# Altium schematic sheet PR2387_FETs.SchDoc: FETs
size 431 x 279 mm; Date: Not shown in title block; ApprovedBy: Not shown in title block; CheckedBy: Not shown in title block; Author: Not shown in title block; CompanyName: Not shown in title block; DrawnBy: M Sunna; Engineer: Not shown in title block; Organization: Not shown in title block; Address1: Not shown in title block; Address2: Not shown in title block; Address3: Not shown in title block; Address4: Not shown in title block; DocumentNumber: 2; Revision: Use project parameter SCH_Rev; SheetNumber: 2; SheetTotal: 3; PageSetup: Record=PageOptions|CenterHorizontal=True|CenterVertical=True|PrintScale=1.00|XCorrection=1.00|YCorrection=1.00|PrintKind=0|BorderSize=5000000|LeftOffset=0|BottomOffset=0|Orientation=2|PaperLength=1000|PaperWidth=1000|Scale=100|PaperSource=15|PrintQuality=600|MediaType=1|DitherType=10|PaperKind=Letter|PrintScaleMode=1; CurrentTime: Not shown in title block; CurrentDate: Not shown in title block; Time: Not shown in title block; DocumentFullPathAndName: Not shown in title block; DocumentName: Not shown in title block; ModifiedDate: Not shown in title block; ImagePath: Not shown in title block
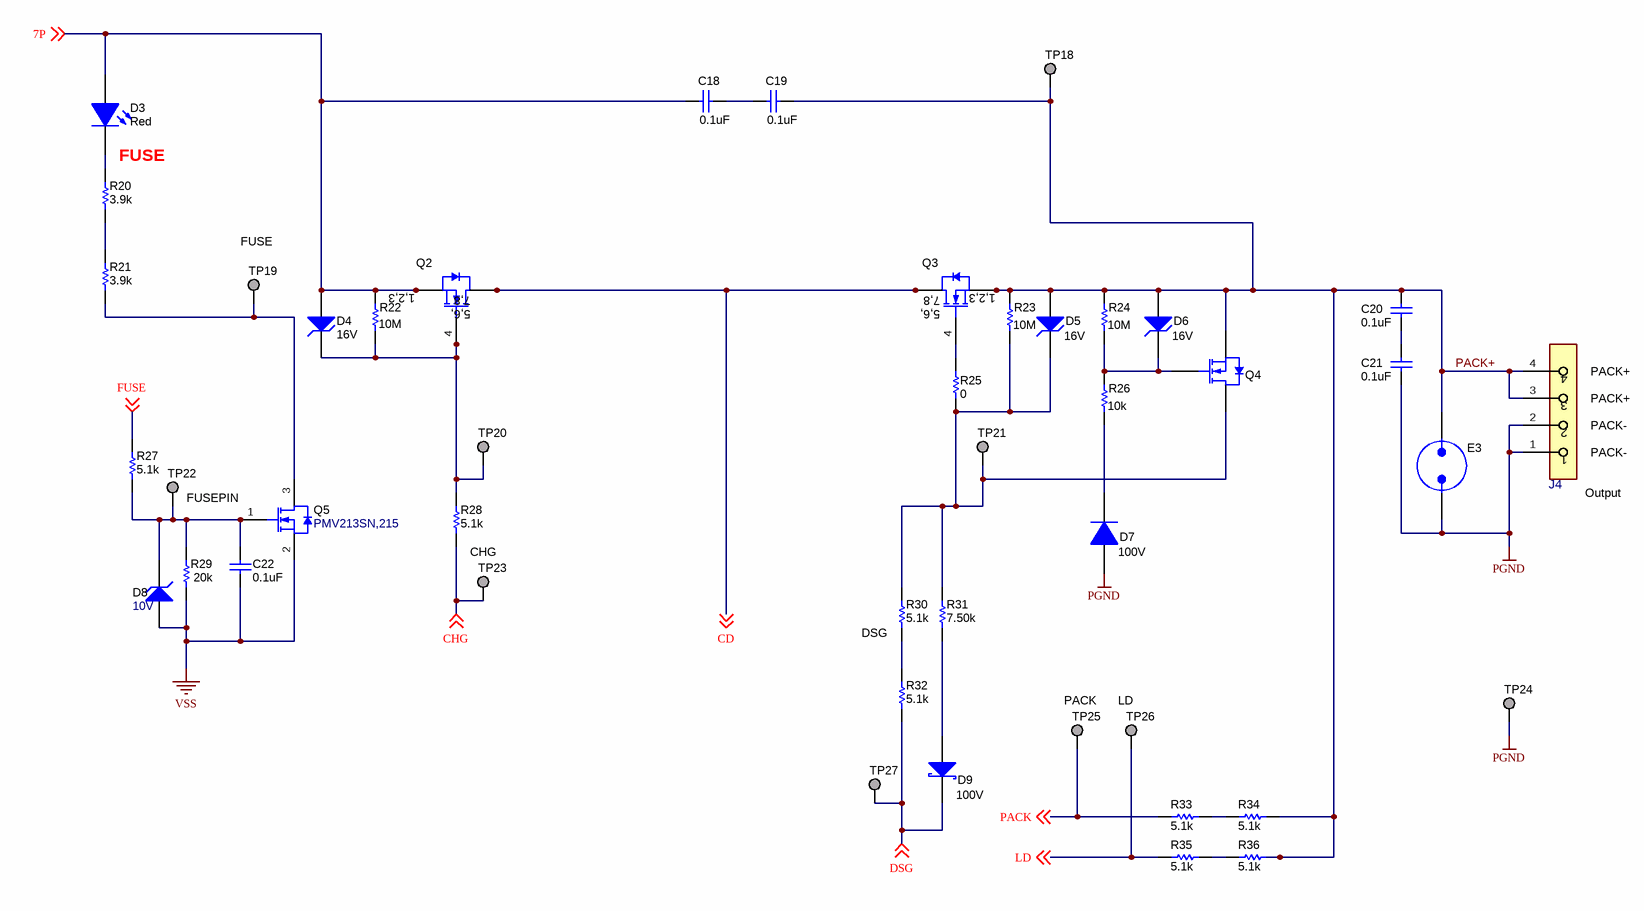
[diagram p0: PR2387_FETs.SchDoc]

## Parts
C18  ValueDisplayed: 0.1uF  [0603]  (hidden comment: GCJ188R72A104KA01D)
C19  ValueDisplayed: 0.1uF  [0603]  (hidden comment: GCJ188R72A104KA01D)
C20  ValueDisplayed: 0.1uF  [0603]  (hidden comment: GCJ188R72A104KA01D)
C21  ValueDisplayed: 0.1uF  [0603]  (hidden comment: GCJ188R72A104KA01D)
C22  ValueDisplayed: 0.1uF  [0603]  (hidden comment: 885012206095)
D3  value Red  [WL-SMCW_RED]  (hidden comment: 150060RS75000)
D4  value 16V  [SOD-123]  (hidden comment: MMSZ5246B-7-F)
D5  value 16V  [SOD-123]  (hidden comment: MMSZ5246B-7-F)
D6  value 16V  [SOD-123]  (hidden comment: MMSZ5246B-7-F)
D7  value 100V  [SOD-123]  (hidden comment: 1N4148W-7-F)
D8  value 10V  [SOD-123]  (hidden comment: MMSZ4697T1G)
D9  Vr_V: 100V  [SOD-123]  (hidden comment: BAT46W-7-F)
E3  Spark Gap  [SPARK_GAP2]  (value not drawn)  (no BOM)
J4  OSTTE040161  [FP-OSTTE040161_HDR4-MFG]  (value not drawn)
Q2  CSD19532Q5B  [DNK0008A]  (value not drawn)
Q3  CSD19532Q5B  [DNK0008A]  (value not drawn)
Q4  MOSFET_N_D3G1S2  [SOT-323]  (value not drawn)
Q5  PMV213SN,215  [SOT-23]
R20  ValueDisplayed: 3.9k  [0603]  (hidden comment: CRCW06033K90JNEA)
R21  ValueDisplayed: 3.9k  [0603]  (hidden comment: CRCW06033K90JNEA)
R22  ValueDisplayed: 10M  [0603]  (hidden comment: Resistor)
R23  ValueDisplayed: 10M  [0603]  (hidden comment: Resistor)
R24  ValueDisplayed: 10M  [0603]  (hidden comment: Resistor)
R25  ValueDisplayed: 0  [0603]  (hidden comment: CRCW06030000Z0EA)
R26  ValueDisplayed: 10k  [0603]  (hidden comment: Resistor)
R27  ValueDisplayed: 5.1k  [0603]  (hidden comment: Resistor)
R28  ValueDisplayed: 5.1k  [0603]  (hidden comment: CRCW06035K10JNEA)
R29  ValueDisplayed: 20k  [0603]  (hidden comment: Resistor)
R30  ValueDisplayed: 5.1k  [1206]  (hidden comment: CRCW12065K10JNEA)
R31  ValueDisplayed: 7.50k  [0603]  (hidden comment: CRCW06037K50FKEA)
R32  ValueDisplayed: 5.1k  [1206]  (hidden comment: CRCW12065K10JNEA)
R33  ValueDisplayed: 5.1k  [1206]  (hidden comment: CRCW12065K10JNEA)
R34  ValueDisplayed: 5.1k  [1206]  (hidden comment: CRCW12065K10JNEA)
R35  ValueDisplayed: 5.1k  [1206]  (hidden comment: CRCW12065K10JNEA)
R36  ValueDisplayed: 5.1k  [1206]  (hidden comment: CRCW12065K10JNEA)
TP18  TESTPOINT  [TP_VIA_060RND040]  (value not drawn)  (no BOM)
TP19  TESTPOINT  [TP_VIA_060RND040]  (value not drawn)  (no BOM)
TP20  TESTPOINT  [TP_VIA_060RND040]  (value not drawn)  (no BOM)
TP21  TESTPOINT  [TP_VIA_060RND040]  (value not drawn)  (no BOM)
TP22  TESTPOINT  [TP_VIA_060RND040]  (value not drawn)  (no BOM)
TP23  TESTPOINT  [TP_VIA_060RND040]  (value not drawn)  (no BOM)
TP24  TESTPOINT  [TP_VIA_060RND040]  (value not drawn)  (no BOM)
TP25  TESTPOINT  [TP_VIA_060RND040]  (value not drawn)  (no BOM)
TP26  TESTPOINT  [TP_VIA_060RND040]  (value not drawn)  (no BOM)
TP27  TESTPOINT  [TP_VIA_060RND040]  (value not drawn)  (no BOM)

## Nets
PGND: C21.2 D7.2(A) E3.2 J4.1 J4.2 TP24.1
VSS: C22.1 D8.2(A) Q5.2(S) R29.1
7P: C18.2 D3.2(A) D4.2(A) Q2.1(S) Q2.2(S) Q2.3(S) R22.1 ; off-sheet 7P
CD: Q2.5(D) Q2.6(D) Q2.7(D) Q2.8(D) Q2.9(D) Q3.5(D) Q3.6(D) Q3.7(D) Q3.8(D) Q3.9(D) ; off-sheet CD
CHG: R28.1 TP23.1 ; off-sheet CHG
DSG: D9.1(K) R32.1 TP27.1 ; off-sheet DSG
FUSE: R27.2 ; off-sheet FUSE
LD: R35.2 TP26.1 ; off-sheet LD
PACK: R33.2 TP25.1 ; off-sheet PACK
PACK+: C19.1 C20.1 D5.2(A) D6.2(A) E3.1 J4.3 J4.4 Q3.1(S) Q3.2(S) Q3.3(S) Q4.2(S) R23.1 R24.1 R34.1 R36.1 TP18.1
NetC18_1: C18.1 C19.2
NetC20_2: C20.2 C21.1
NetC22_2: C22.2 D8.1(K) Q5.1(G) R27.1 R29.2 TP22.1
NetD3_1: D3.1(K) R20.2
NetD4_1: D4.1(K) Q2.4(G) R22.2 R28.2 TP20.1
NetD5_1: D5.1(K) Q4.3(D) R23.2 R25.2 R30.2 R31.2 TP21.1
NetD6_1: D6.1(K) Q4.1(G) R24.2 R26.1
NetD7_1: D7.1(K) R26.2
NetD9_2: D9.2(A) R31.1
NetQ3_4: Q3.4(G) R25.1
NetQ5_3: Q5.3(D) R21.1 TP19.1
NetR20_1: R20.1 R21.2
NetR30_1: R30.1 R32.2
NetR33_1: R33.1 R34.2
NetR35_1: R35.1 R36.2

## Notes on the sheet
- FUSE
- (near TP19) FUSE
- (near J4) PACK+
- (near J4) PACK-
- (near TP22) FUSEPIN
- (near J4) Output
- CHG
- (near R30) DSG
- (near TP25) PACK
- (near TP26) LD
- (in symbol CMP-0000958-3) 7,8; 1,2,3; 5,6,

## Library data of the parts
C18-C21 = CMP-0064935-4: CAP, CERM, 0.1 uF, 100 V,+/- 10%, X7R, AEC-Q200 Grade 1, 0603; Manufacturer: MuRata; TaMin_C: -55°C; Polarized: N; SizeAreaWB_mm2: 4.68; Value1: Unknown; U/M: EA; Value: 0.1uF; TaMax_C: 125°C; SizeZ_mm: 1; SizeX_mm: 1.6; SizeY_mm: 0.8; Value2: 100V; SizeArea_mm2: 1.28; AEC Qualified: Y; Cap_F: 100nF; AEC Category: Q200; Supplier Part Number 2: 81-GCJ188R72A104KA1D; Publisher: Texas Instruments; Supplier 2: Mouser; TempCo: X7R; Published: 2008-06-19; RoHS: Y; MountType: SMT; Supplier 1: Digi-Key; PackageReference: 0603; Tolerance_%: 10%; Cap_Case: 0603; CompType: Capacitor; LatestRevisionDate: 2017-06-05; PartNumber: GCJ188R72A104KA01D; VDC_V: 100V; ComponentLink1Description: Datasheet link; AEC Grade: 1; Supplier Part Number 1: 490-13420-1-ND; Technology: Ceramic; ComponentLink1URL: http://search.murata.co.jp/Ceramy/image/img/A01X/G101/ENG/GCJ188R72A104KA01-01.pdf
C22 = CMP-0006837-4: CAP, CERM, 0.1 uF, 50 V, +/- 10%, X7R, 0603; Manufacturer: Wurth Elektronik; Polarized: N; Value: 0.1uF; U/M: EA; Cap_F: 100nF; Value1: Unknown; VDC_V: 50V; TaMin_C: -55°C; TaMax_C: 125°C; SizeArea_mm2: 1.28; SizeAreaWB_mm2: 4.68; SizeX_mm: 1.6; SizeY_mm: 0.8; SizeZ_mm: 1; AEC Category: Q200; CompType: Capacitor; PartNumber: 885012206095; PackageReference: 0603; RoHS: Y; Tolerance_%: 10%; Value2: 50V; MountType: SMT; Technology: Ceramic; TempCo: X7R; Cap_Case: 0603; Published: 2008-06-19; Publisher: Texas Instruments; LatestRevisionDate: 2017-03-09; ComponentLink1Description: Datasheet link; ComponentLink1URL: http://katalog.we-online.de/pbs/datasheet/885012206095.pdf; AEC Qualified: N; AEC Grade: N/A
D3 = CMP-0002947-3: LED, Red, SMD; Manufacturer: Wurth Elektronik; Type: AlInGaP; Vf_V: 2V; Io_A: 30mA; Vr_V: 5V; Tjmax_C: 85°C; Power_TotalModule: 72mW; Value1: 0.072W; Angle: 140; CompType: LED; PartNumber: 150060RS75000; MountType: SMT; RoHS: Y; PackageReference: LED_0603; Value2: 2V; Color: Red; ComponentLink1URL: http://katalog.we-online.de/led/datasheet/150060RS75000.pdf; ComponentLink1Description: Datasheet link
D4 = CMP-0005754-4: Diode, Zener, 16 V, 500 mW, SOD-123; Manufacturer: Diodes Inc.; Power_W: 500mW; SizeAreaWB_mm2: 13.095; Value1: 0.5W; RJA_CperW: 350; SizeZ_mm: 1.35; SizeX_mm: 3.85; SizeY_mm: 1.7; SizeArea_mm2: 6.545; AEC Category: Q101; Vz_V: 16V; RoHS: Y; MountType: SMT; PackageReference: SOD-123; CompType: Zener; PartNumber: MMSZ5246B-7-F; AEC Qualified: ?; ComponentLink1Description: Datasheet link; ComponentLink1URL: http://www.diodes.com/datasheets/ds18010.pdf
D5 D6 = CMP-0005754-4: Diode, Zener, 16 V, 500 mW, SOD-123; Manufacturer: Diodes Inc.; Power_W: 500mW; SizeY_mm: 1.7; Value1: 0.5W; SizeX_mm: 3.85; RJA_CperW: 350; SizeAreaWB_mm2: 13.095; SizeArea_mm2: 6.545; AEC Category: Q101; SizeZ_mm: 1.35; MountType: SMT; Vz_V: 16V; PackageReference: SOD-123; PartNumber: MMSZ5246B-7-F; AEC Qualified: ?; CompType: Zener; ComponentLink1Description: Datasheet link; RoHS: Y; ComponentLink1URL: http://www.diodes.com/datasheets/ds18010.pdf
D7 = CMP-0029001-2: Diode, Ultrafast, 100 V, 0.15 A, SOD-123; Manufacturer: Diodes Inc.; Vf_V: 1.25V; Value1: 0.15A; Io_A: 1.5dA; TJmax_C: 150°C; SizeAreaWB_mm2: 13.095; SizeArea_mm2: 6.545; SizeX_mm: 3.85; SizeY_mm: 1.7; SizeZ_mm: 1.35; AEC Category: Q101; Green_Lifecycle: Active; Green_REACh: Passed; PartNumber: 1N4148W-7-F; PackageReference: SOD-123; CompType: Diode; Value2: 1.25V; Vr_V: 100V; MountType: SMT; Type: Ultrafast; RoHS: Y; ComponentLink1Description: Datasheet link; ComponentLink1URL: http://www.diodes.com/datasheets/ds30086.pdf; AEC Qualified: ?; Green_EU RoHS: Passed; Green_EU RoHS-2: Passed
D8 = CMP-0005740-3: Diode, Zener, 10 V, 500 mW, SOD-123; Manufacturer: ON Semiconductor; SizeY_mm: 1.7; SizeX_mm: 3.85; RJA_CperW: 340; SizeAreaWB_mm2: 13.095; AEC Category: Q101; Power_W: 500mW; SizeZ_mm: 1.35; Value1: 0.5W; SizeArea_mm2: 6.545; PackageReference: SOD-123; AEC Qualified: ?; MountType: SMT; RoHS: Y; ComponentLink1Description: Datasheet link; PartNumber: MMSZ4697T1G; CompType: Zener; ComponentLink1URL: http://www.onsemi.com/pub_link/Collateral/MMSZ4678T1-D.PDF; Vz_V: 10V
D9 = CMP-0028450-2: Diode, Schottky, 100 V, 0.15 A, SOD-123; Manufacturer: Diodes Inc.; Value: 100V; Io_A: 150mA; SizeArea_mm2: 6.545; SizeX_mm: 3.85; Value2: 0.6V; Value1: 0.15A; AEC Category: Q101; SizeZ_mm: 1.35; SizeY_mm: 1.7; Green_Lifecycle: Active; Green_REACh: Passed; SizeAreaWB_mm2: 13.095; Vf_V: 600mV; ComponentLink1Description: Datasheet link; MountType: SMT; ComponentLink1URL: http://www.diodes.com/datasheets/ds30044.pdf; PartNumber: BAT46W-7-F; Type: Schottky; AEC Qualified: ?; Green_EU RoHS-2: Passed; Green_EU RoHS: Passed; CompType: Diode; RoHS: Y; PackageReference: SOD-123
E3 = CMP-0079939-1: CompType: Spark Gap
J4 = CMP-0087048-1: TERM BLOCK 3.5MM VERT 4POS PCB; Manufacturer: On Shore Technology; Row_Count: 1; Current_A: 10A; ContactFinish: Tin; Voltage_V: 300V; PinCount: 4; Symbol Name: SYM-OSTTE040161; PartNumber: OSTTE040161; PackageReference: HDR4; ComponentLink1URL: http://www.on-shore.com/wp-content/uploads/2019/02/OSTTEXX0161.pdf; ComponentLink1Description: Datasheet; RoHS: TRUE
Q2 Q3 = CMP-0000958-3: MOSFET, N-CH, 100 V, 17 A, DNK0008A (VSON-CLIP-8); Alternate Manufacturer: None; Manufacturer: Texas Instruments; SizeZ_mm: 1; ChType: N; Value2: 48 nC; VdsMax_V: 100V; SizeX_mm: 6; SizeY_mm: 5; Vgs_V: 20V; QgTyp_nC: 48; Value: 100V; SizeArea_mm2: 30; AEC Category: Q101; IdsMax_A: 17A; SizeAreaWB_mm2: 56; U/M: EA; Supplier 2: Farnell; Supplier 1: Digi-Key; Supplier Part Number 1: 296-37478-6-ND; Supplier Part Number 2: 2413268; PartNumber: CSD19532Q5B; ComponentLink1Description: Datasheet link; CompType: MOSFET; AEC Qualified: N; RoHS: Y; PackageReference: DNK0008A; MountType: SMT; ComponentLink1URL: http://www.ti.com/lit/ds/symlink/csd19532q5b.pdf
Q4 = CMP-0000774-1: MOSFET, N-CH, 60 V, 0.31 A, SOT-323; PartNumber: 2N7002KW; Manufacturer: Fairchild Semiconductor; Alternate Manufacturer: None; Value: 60V; U/M: EA; ChType: N; Value1: 1; Rdson45_ohm: 1.6; Vgs_V: 2.1V; IdsMax_A: 3.1dA; SizeAreaWB_mm2: 10.24; SizeArea_mm2: 4.84; SizeX_mm: 2.2; SizeZ_mm: 1.1; AEC Category: Q101; Green_Lifecycle: Active; Green_REACh: Passed; SymbolVersion: 2008-07-28; CompType: MOSFET; PackageReference: SOT-323; VdsMax_V: 60V; RoHS: Y; MountType: SMT; Published: 2008-06-19; Publisher: Texas Instruments; LatestRevisionDate: 2017-03-09; LatestRevisionNote: Added parts.; ComponentLink1Description: Datasheet link; ComponentLink1URL: http://www.fairchildsemi.com/ds/2N/2N7002KW.pdf; Supplier 1: Digi-Key; Supplier Part Number 1: 2N7002KWCT-ND; Supplier 2: Mouser; Supplier Part Number 2: 512-2N7002KW; SizeY_mm: 2.2; AEC Qualified: ?; Green_EU RoHS: Passed; Green_EU RoHS-2: Passed
Q5 = CMP-0001015-3: MOSFET, N-CH, 100 V, 1.9 A, SOT-23; Alternate Manufacturer: None; Manufacturer: Nexperia; SizeZ_mm: 1.1; ChType: N; Value2: 7 nC; VdsMax_V: 100V; SizeX_mm: 2.5; SizeY_mm: 3; Vgs_V: 30V; QgTyp_nC: 7; Value: 100V; SizeArea_mm2: 7.5; AEC Category: Q101; IdsMax_A: 1.9A; SizeAreaWB_mm2: 14; Supplier 2: Mouser; Supplier 1: Digi-Key; Supplier Part Number 1: 568-8112-1-ND; Supplier Part Number 2: 771-PMV213SN215; PartNumber: PMV213SN,215; ComponentLink1Description: Datasheet link; CompType: MOSFET; AEC Qualified: N; RoHS: Y; PackageReference: SOT-23; MountType: SMT; ComponentLink1URL: http://www.nexperia.com/documents/data_sheet/PMV213SN.pdf
R20 R21 = CMP-0025799-4: RES, 3.9 k, 5%, 0.1 W, AEC-Q200 Grade 0, 0603; Manufacturer: Vishay-Dale; Power_W: 100mW; TempCo: 200 ppm/C; Value_Code: 3k90; Value: 3.9k; EIA_Code: E24; SizeX_mm: 1.6; SizeY_mm: 0.8; SizeZ_mm: 1; Value2: 0.1W; SizeArea_mm2: 1.28; AEC Qualified: Y; VDC_V: 75V; AEC Category: Q200; AEC Grade: 0; Supplier Part Number 2: 72M6834; Supplier 2: Newark; Supplier Part Number 3: 71-CRCW0603J-3.9K-E3; Supplier 3: Mouser; RoHS: E; Value1: 5%; MountType: SMT; Supplier 1: Digi-Key; PackageReference: 0603; Tolerance_%: 5%; Res_ohm: 3.9k; CompType: Resistor; PartNumber: CRCW06033K90JNEA; ComponentLink1Description: Datasheet link; Supplier Part Number 1: 541-3.9KGCT-ND; Technology: Thick Film; ComponentLink1URL: http://www.vishay.com/docs/20035/dcrcwe3.pdf
R22-R24 = CMP-0025702-4: RES, 10 M, 5%, 0.1 W, AEC-Q200 Grade 0, 0603; PartNumber: CRCW060310M0JNEA; Manufacturer: Vishay-Dale; Value: 10Meg; Value_Code: 10M0; Power_W: 100mW; Value2: 0.1W; VDC_V: 75V; TempCo: 200 ppm/C; EIA_Code: E24; U/M: EA; SizeArea_mm2: 1.28; SizeX_mm: 1.6; SizeY_mm: 0.8; SizeZ_mm: 1; AEC Category: Q200; AEC Qualified: Y; AEC Grade: 0; CompType: Resistor; SymbolVersion: 2009-05-29; PackageReference: 0603; RoHS: E; Res_ohm: 10M; Tolerance_%: 5%; Value1: 5%; MountType: SMT; Technology: Thick Film; Published: 2008-06-26; Publisher: Texas Instruments; LatestRevisionDate: 2017-06-13; ComponentLink1Description: Datasheet link; ComponentLink1URL: http://www.vishay.com/docs/20035/dcrcwe3.pdf; Supplier 1: Digi-Key; Supplier Part Number 1: 541-10MGCT-ND; Supplier 2: Newark; Supplier Part Number 2: 59M6761; Supplier 3: Mouser; Supplier Part Number 3: 71-CRCW0603J-10M-E3
R25 = CMP-0025697-4: RES, 0, 5%, 0.1 W, AEC-Q200 Grade 0, 0603; Manufacturer: Vishay-Dale; Value: 0; Value_Code: 0000; Power_W: 100mW; Value2: 0.1W; VDC_V: 75V; TempCo: 200 ppm/C; EIA_Code: E24; SizeArea_mm2: 1.28; SizeX_mm: 1.6; SizeY_mm: 0.8; SizeZ_mm: 1; AEC Category: Q200; AEC Qualified: Y; CompType: Resistor; PartNumber: CRCW06030000Z0EA; PackageReference: 0603; RoHS: E; Res_ohm: 0; Tolerance_%: 5%; Value1: 5%; MountType: SMT; Technology: Thick Film; ComponentLink1Description: Datasheet link; ComponentLink1URL: http://www.vishay.com/docs/20035/dcrcwe3.pdf; Supplier 1: Digi-Key; Supplier Part Number 1: 541-0.0GCT-ND; Supplier 2: Newark; Supplier Part Number 2: 52K8014; Supplier 3: Mouser; Supplier Part Number 3: 71-CRCW0603-0-E3; AEC Grade: 0
R26 = CMP-0025701-4: RES, 10 k, 5%, 0.1 W, AEC-Q200 Grade 0, 0603; PartNumber: CRCW060310K0JNEA; Manufacturer: Vishay-Dale; Value: 10k; Value_Code: 10k0; Power_W: 100mW; Value2: 0.1W; VDC_V: 75V; TempCo: 200 ppm/C; EIA_Code: E24; U/M: EA; SizeArea_mm2: 1.28; SizeX_mm: 1.6; SizeY_mm: 0.8; SizeZ_mm: 1; AEC Category: Q200; AEC Qualified: Y; AEC Grade: 0; CompType: Resistor; SymbolVersion: 2009-05-29; PackageReference: 0603; RoHS: E; Res_ohm: 10k; Tolerance_%: 5%; Value1: 5%; MountType: SMT; Technology: Thick Film; Published: 2008-06-26; Publisher: Texas Instruments; LatestRevisionDate: 2017-06-13; ComponentLink1Description: Datasheet link; ComponentLink1URL: http://www.vishay.com/docs/20035/dcrcwe3.pdf; Supplier 1: Digi-Key; Supplier Part Number 1: 541-10KGCT-ND; Supplier 2: Newark; Supplier Part Number 2: 52K8066; Supplier 3: Mouser; Supplier Part Number 3: 71-CRCW0603J-10K-E3
R27 = CMP-0025830-4: RES, 5.1 k, 5%, 0.1 W, AEC-Q200 Grade 0, 0603; PartNumber: CRCW06035K10JNEA; Manufacturer: Vishay-Dale; Value: 5.1k; Value_Code: 5k10; Power_W: 100mW; Value2: 0.1W; VDC_V: 75V; TempCo: 200 ppm/C; EIA_Code: E24; U/M: EA; SizeArea_mm2: 1.28; SizeX_mm: 1.6; SizeY_mm: 0.8; SizeZ_mm: 1; AEC Category: Q200; AEC Qualified: Y; AEC Grade: 0; CompType: Resistor; SymbolVersion: 2009-05-29; PackageReference: 0603; RoHS: E; Res_ohm: 5.1k; Tolerance_%: 5%; Value1: 5%; MountType: SMT; Technology: Thick Film; Published: 2008-06-26; Publisher: Texas Instruments; LatestRevisionDate: 2017-06-13; ComponentLink1Description: Datasheet link; ComponentLink1URL: http://www.vishay.com/docs/20035/dcrcwe3.pdf; Supplier 1: Digi-Key; Supplier Part Number 1: 541-5.1KGCT-ND; Supplier 2: Newark; Supplier Part Number 2: 89M6773; Supplier 3: Farnell; Supplier Part Number 3: 1570751
R28 = CMP-0025830-4: RES, 5.1 k, 5%, 0.1 W, AEC-Q200 Grade 0, 0603; Manufacturer: Vishay-Dale; Value: 5.1k; Value_Code: 5k10; Power_W: 100mW; Value2: 0.1W; VDC_V: 75V; TempCo: 200 ppm/C; SizeArea_mm2: 1.28; SizeX_mm: 1.6; SizeY_mm: 0.8; SizeZ_mm: 1; EIA_Code: E24; AEC Category: Q200; AEC Qualified: Y; AEC Grade: 0; CompType: Resistor; PartNumber: CRCW06035K10JNEA; PackageReference: 0603; RoHS: E; Res_ohm: 5.1k; Tolerance_%: 5%; Value1: 5%; MountType: SMT; Technology: Thick Film; ComponentLink1Description: Datasheet link; ComponentLink1URL: http://www.vishay.com/docs/20035/dcrcwe3.pdf; Supplier 1: Digi-Key; Supplier Part Number 1: 541-5.1KGCT-ND; Supplier 2: Newark; Supplier Part Number 2: 89M6773; Supplier 3: Farnell; Supplier Part Number 3: 1570751
R29 = CMP-0025753-4: RES, 20 k, 5%, 0.1 W, AEC-Q200 Grade 0, 0603; PartNumber: CRCW060320K0JNEA; Manufacturer: Vishay-Dale; Value: 20k; Value_Code: 20k0; Power_W: 100mW; Value2: 0.1W; VDC_V: 75V; TempCo: 200 ppm/C; EIA_Code: E24; U/M: EA; SizeArea_mm2: 1.28; SizeX_mm: 1.6; SizeY_mm: 0.8; SizeZ_mm: 1; AEC Category: Q200; AEC Qualified: Y; AEC Grade: 0; CompType: Resistor; SymbolVersion: 2009-05-29; PackageReference: 0603; RoHS: E; Res_ohm: 20k; Tolerance_%: 5%; Value1: 5%; MountType: SMT; Technology: Thick Film; Published: 2008-06-26; Publisher: Texas Instruments; LatestRevisionDate: 2017-06-13; ComponentLink1Description: Datasheet link; ComponentLink1URL: http://www.vishay.com/docs/20035/dcrcwe3.pdf; Supplier 1: Digi-Key; Supplier Part Number 1: 541-20KGCT-ND; Supplier 2: Newark; Supplier Part Number 2: 59M6783; Supplier 3: Mouser; Supplier Part Number 3: 71-CRCW0603J-20K-E3
R30 R32-R36 = CMP-0018703-3: RES, 5.1 k, 5%, 0.25 W, AEC-Q200 Grade 0, 1206; Manufacturer: Vishay-Dale; Value: 5.1k; Value_Code: 5k10; Power_W: 250mW; Value2: 0.25W; VDC_V: 200V; TempCo: 200 ppm/C; SizeArea_mm2: 5.12; SizeX_mm: 3.2; SizeY_mm: 1.6; SizeZ_mm: 1.35; EIA_Code: E24; AEC Category: Q200; AEC Qualified: Y; AEC Grade: 0; CompType: Resistor; PartNumber: CRCW12065K10JNEA; PackageReference: 1206; RoHS: E; Res_ohm: 5.1k; Tolerance_%: 5%; Value1: 5%; MountType: SMT; Technology: Thick Film; ComponentLink1Description: Datasheet link; ComponentLink1URL: http://www.vishay.com/docs/20035/dcrcwe3.pdf; Supplier 1: Digi-Key; Supplier Part Number 1: 541-5.1KECT-ND; Supplier 2: Newark; Supplier Part Number 2: 59M8589; Supplier 3: Mouser; Supplier Part Number 3: 71-CRCW1206J-5.1K-E3
R31 = CMP-0022601-4: RES, 7.50 k, 1%, 0.1 W, AEC-Q200 Grade 0, 0603; Manufacturer: Vishay-Dale; Power_W: 100mW; TempCo: 100 ppm/C; Value_Code: 7k50; Value: 7.50k; EIA_Code: E96; Res_ohm: 7.5k; SizeX_mm: 1.6; SizeY_mm: 0.8; SizeZ_mm: 1; Value2: 0.1W; SizeArea_mm2: 1.28; AEC Qualified: Y; VDC_V: 75V; AEC Category: Q200; AEC Grade: 0; Supplier Part Number 2: 52K8696; Supplier 2: Newark; Supplier Part Number 3: 71-CRCW0603-7.5K-E3; Supplier 3: Mouser; RoHS: E; Value1: 1%; MountType: SMT; Supplier 1: Digi-Key; PackageReference: 0603; Tolerance_%: 1%; CompType: Resistor; PartNumber: CRCW06037K50FKEA; ComponentLink1Description: Datasheet link; Supplier Part Number 1: 541-7.50KHCT-ND; Technology: Thick Film; ComponentLink1URL: http://www.vishay.com/docs/20035/dcrcwe3.pdf
TP18-TP27 = CMP-0078143-3: TEST POINT.  No entry in BOM.; CompType: Testpoint; PackageReference: N/A; Library Reference: TESTPOINT; Manufacturer: N/A; PartNumber: N/A